# Altium schematic sheet 6_radio_1.schdoc: Radio 1
size A4; DrawnBy: Sara Vega Martinez; Revision: v0.1; SheetNumber: 6; SheetTotal: 6; DesignedBy: André M. P. Mattos
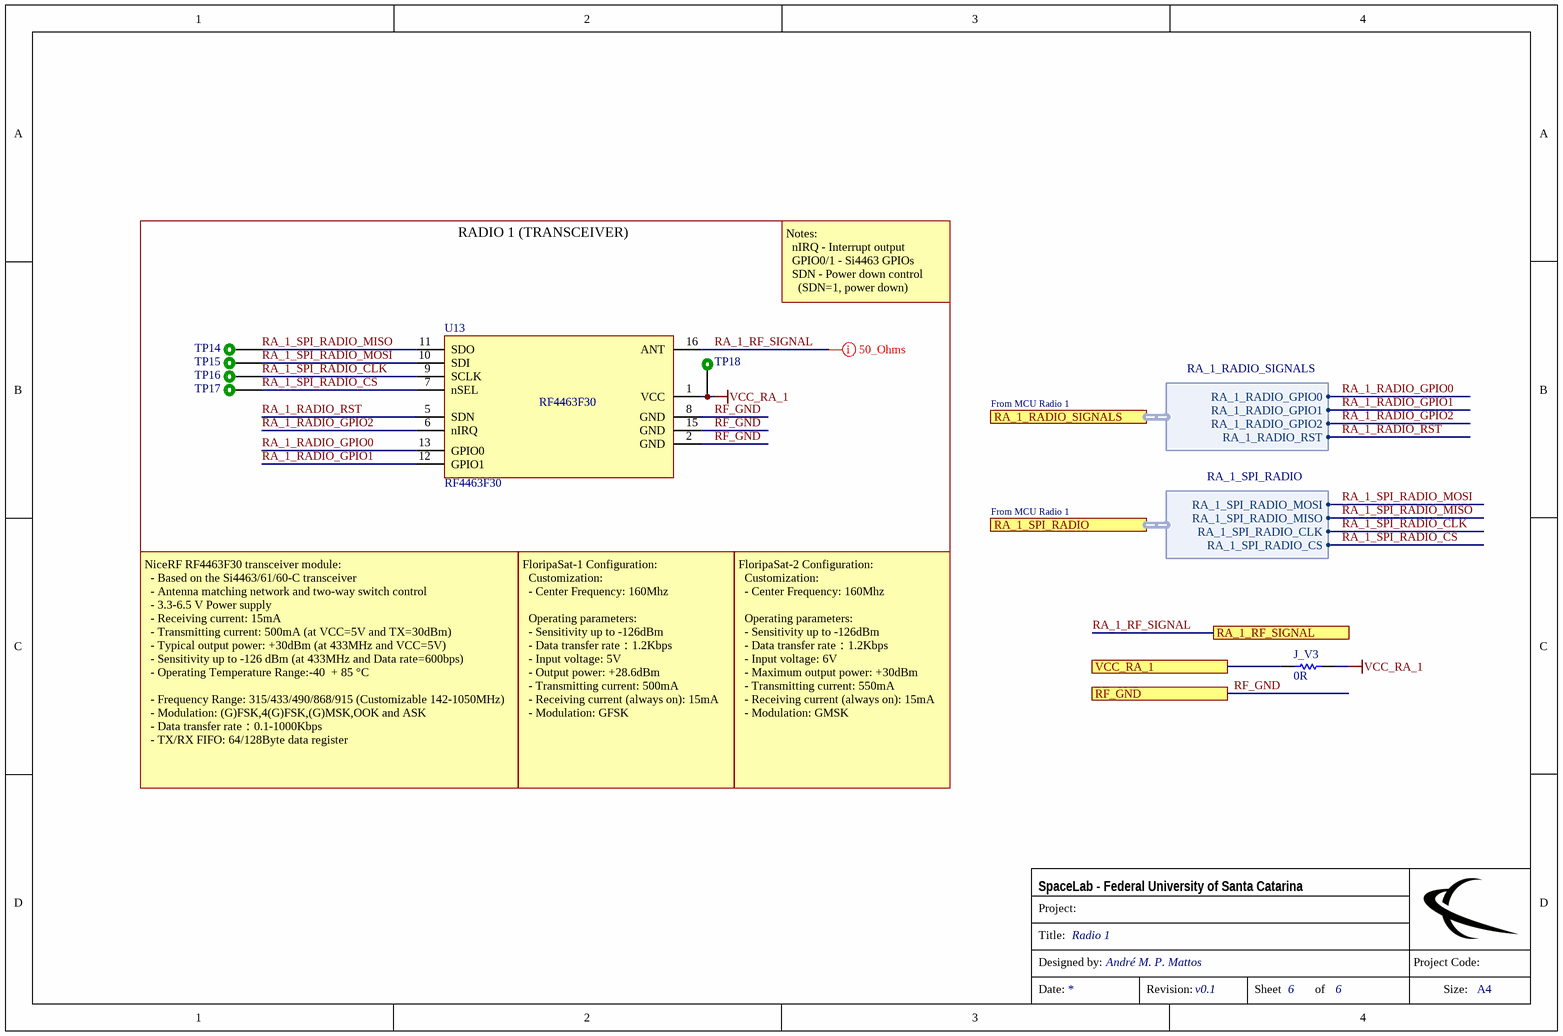
[diagram p0: 6_radio_1.schdoc]

## Parts
J_V3  0R  [0805]
TP14  TEST_POINT  [TEST_POINT]  (value not drawn)  (no BOM)
TP15  TEST_POINT  [TEST_POINT]  (value not drawn)  (no BOM)
TP16  TEST_POINT  [TEST_POINT]  (value not drawn)  (no BOM)
TP17  TEST_POINT  [TEST_POINT]  (value not drawn)  (no BOM)
TP18  TEST_POINT  [TEST_POINT]  (value not drawn)  (no BOM)
U13  RF4463F30  [RF4463F30]

## Blocks framed on the sheet
RADIO 1 (TRANSCEIVER): TP14-TP18 U13

## Ports
RA_1_RADIO_SIGNALS (harness RA_1_RADIO_SIGNALS), RA_1_RF_SIGNAL, RA_1_SPI_RADIO (harness RA_1_SPI_RADIO), RF_GND, VCC_RA_1

## Harnesses
RA_1_RADIO_SIGNALS: RA_1_RADIO_GPIO2, RA_1_RADIO_RST, RA_1_RADIO_GPIO0, RA_1_RADIO_GPIO1
RA_1_SPI_RADIO: RA_1_SPI_RADIO_CLK, RA_1_SPI_RADIO_MISO, RA_1_SPI_RADIO_MOSI, RA_1_SPI_RADIO_CS

## Nets
VCC_RA_1: J_V3.1 TP18.1 U13.1(VCC)
RA_1_RADIO_GPIO0: U13.13(GPIO0) ; port RA_1_RADIO_SIGNALS.RA_1_RADIO_GPIO0
RA_1_RADIO_GPIO1: U13.12(GPIO1) ; port RA_1_RADIO_SIGNALS.RA_1_RADIO_GPIO1
RA_1_RADIO_GPIO2: U13.6(nIRQ) ; port RA_1_RADIO_SIGNALS.RA_1_RADIO_GPIO2
RA_1_RADIO_RST: U13.5(SDN) ; port RA_1_RADIO_SIGNALS.RA_1_RADIO_RST
RA_1_RF_SIGNAL: U13.16(ANT) ; port RA_1_RF_SIGNAL
RA_1_SPI_RADIO_CLK: TP16.1 U13.9(SCLK) ; port RA_1_SPI_RADIO.RA_1_SPI_RADIO_CLK
RA_1_SPI_RADIO_CS: TP17.1 U13.7(nSEL) ; port RA_1_SPI_RADIO.RA_1_SPI_RADIO_CS
RA_1_SPI_RADIO_MISO: TP14.1 U13.11(SDO) ; port RA_1_SPI_RADIO.RA_1_SPI_RADIO_MISO
RA_1_SPI_RADIO_MOSI: TP15.1 U13.10(SDI) ; port RA_1_SPI_RADIO.RA_1_SPI_RADIO_MOSI
RF_GND: U13.2(GND) U13.8(GND) U13.15(GND) ; port RF_GND
VCC_RA_1: J_V3.2 ; port VCC_RA_1  [a separate net that carries the same name]

## Layout directives
net class 50Ohm_Net: RA_1_RF_SIGNAL

## Notes on the sheet
- Notes:
  nIRQ - Interrupt output
  GPIO0/1 - Si4463 GPIOs
  SDN - Power down control
  (SDN=1, power down)
- From MCU Radio 1
- NiceRF RF4463F30 transceiver module:
  - Based on the Si4463/61/60-C transceiver
  - Antenna matching network and two-way switch control
  - 3.3-6.5 V Power supply
  - Receiving current: 15mA
  - Transmitting current: 500mA (at VCC=5V and TX=30dBm)
  - Typical output power: +30dBm (at 433MHz and VCC=5V)
  - Sensitivity up to -126 dBm (at 433MHz and Data rate=600bps)
  - Operating Temperature Range:-40  + 85 °C
  - Frequency Range: 315/433/490/868/915 (Customizable 142-1050MHz)
  - Modulation: (G)FSK,4(G)FSK,(G)MSK,OOK and ASK
  - Data transfer rate：0.1-1000Kbps
  - TX/RX FIFO: 64/128Byte data register
- FloripaSat-1 Configuration:
  Customization:
  - Center Frequency: 160Mhz
  Operating parameters:
  - Sensitivity up to -126dBm
  - Data transfer rate：1.2Kbps
  - Input voltage: 5V
  - Output power: +28.6dBm
  - Transmitting current: 500mA
  - Receiving current (always on): 15mA
  - Modulation: GFSK
- FloripaSat-2 Configuration:
  Customization:
  - Center Frequency: 160Mhz
  Operating parameters:
  - Sensitivity up to -126dBm
  - Data transfer rate：1.2Kbps
  - Input voltage: 6V
  - Maximum output power: +30dBm
  - Transmitting current: 550mA
  - Receiving current (always on): 15mA
  - Modulation: GMSK
- Project:
- SpaceLab - Federal University of Santa Catarina
- Title:
- Designed by:
- Project Code:
- Date:
- Revision:
- Sheet
- of
- Size:
- A4

## Library data of the parts
J_V3 = R0R_JUMPER_1/8W_0805: RES 0R OHM 1/8W JUMPER 0805; Partnumber: CRCW08050000Z0EA; NCM: 8533.21.20
TP14-TP18 = TEST_POINT: Test point
U13 = RF4463F30: RF4463F30 High Power Wireless Transceiver Module; Partnumber: RF4463F30